# EAGLE schematic motor_board_tmc (EAGLE 9.6.2)

## Sheet 1 of 3
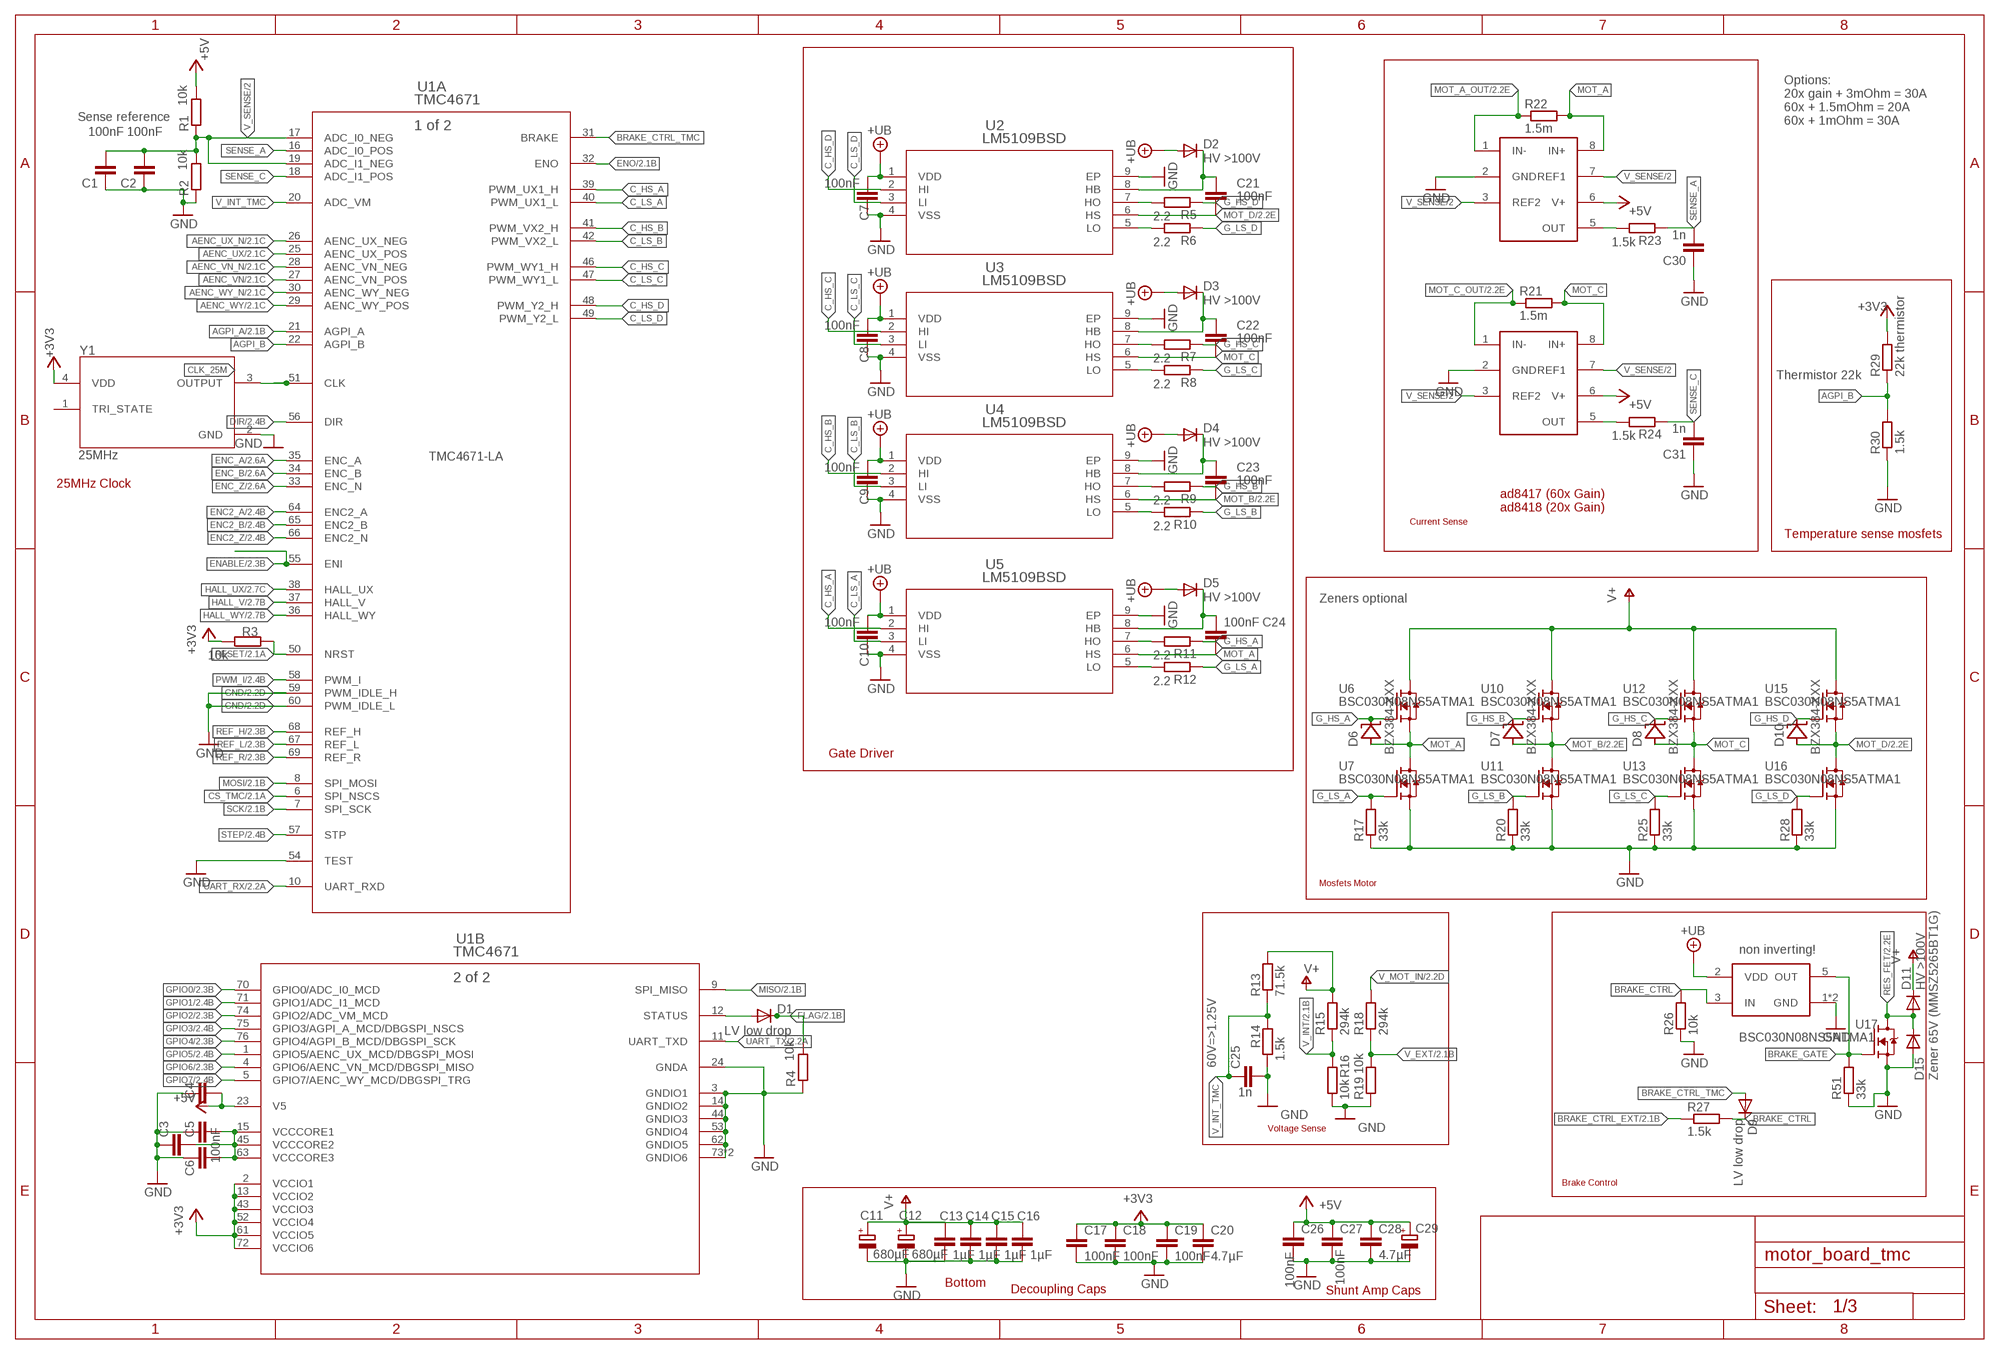
[diagram p0: schematic, sheet 1]

### Parts
C1  100nF  C-EUC0603  [C0603]
C2  100nF  C-EUC0603  [C0603]
C3  100nF  C-EUC0603  [C0603]
C4  100nF  C-EUC0603  [C0603]
C5  100nF  C-EUC0603  [C0603]
C6  100nF  C-EUC0603  [C0603]
C7  100nF  C-EUC0603  [C0603]
C8  100nF  C-EUC0603  [C0603]
C9  100nF  C-EUC0603  [C0603]
C10  100nF  C-EUC0603  [C0603]
C11  680µF  CPOL-EUE7.5-16  [E7,5-16]
C12  680µF  CPOL-EUE7.5-16  [E7,5-16]
C13  1µF  C-EUC1206  [C1206]
C14  1µF  C-EUC1206  [C1206]
C15  1µF  C-EUC1206  [C1206]
C16  1µF  C-EUC1206  [C1206]
C17  100nF  C-EUC0603  [C0603]
C18  100nF  C-EUC0603  [C0603]
C19  100nF  C-EUC0603  [C0603]
C20  4.7µF  C-EUC0805  [C0805]
C21  100nF  C-EUC0805  [C0805]
C22  100nF  C-EUC0805  [C0805]
C23  100nF  C-EUC0805  [C0805]
C24  100nF  C-EUC0805  [C0805]
C25  1n  C-EUC0603  [C0603]
C26  100nF  C-EUC0603  [C0603]
C27  100nF  C-EUC0603  [C0603]
C28  4.7µF  C-EUC0805  [C0805]
C29  CPOL-EUE5-8.5  [E5-8,5]
C30  1n  C-EUC0603  [C0603]
C31  1n  C-EUC0603  [C0603]
D1  LV low drop  DIODE_SOD-123FL  [SOD-123FL]
D2  HV >100V  DIODE_SOD-123FL  [SOD-123FL]
D3  HV >100V  DIODE_SOD-123FL  [SOD-123FL]
D4  HV >100V  DIODE_SOD-123FL  [SOD-123FL]
D5  HV >100V  DIODE_SOD-123FL  [SOD-123FL]
D6  BZX384-XXX  [SOD323-R]
D7  BZX384-XXX  [SOD323-R]
D8  BZX384-XXX  [SOD323-R]
D9  LV low drop  DIODE_SOD-123FL  [SOD-123FL]
D10  BZX384-XXX  [SOD323-R]
D11  HV >100V  DIODE_SOD-123FL  [SOD-123FL]
D15  Zener 65V (MMSZ5265BT1G)  DIODE_SOD-123FL  [SOD-123FL]
R1  10k  R-EU_R0603  [R0603]
R2  10k  R-EU_R0603  [R0603]
R3  10k  R-EU_R0603  [R0603]
R4  10k  R-EU_R0603  [R0603]
R5  2.2  R-EU_R0603  [R0603]
R6  2.2  R-EU_R0603  [R0603]
R7  2.2  R-EU_R0603  [R0603]
R8  2.2  R-EU_R0603  [R0603]
R9  2.2  R-EU_R0603  [R0603]
R10  2.2  R-EU_R0603  [R0603]
R11  2.2  R-EU_R0603  [R0603]
R12  2.2  R-EU_R0603  [R0603]
R13  71.5k  R-EU_R0805  [R0805]
R14  1.5k  R-EU_R0603  [R0603]
R15  294k  R-EU_R0805  [R0805]
R16  10k  R-EU_R0603  [R0603]
R17  33k  R-EU_R0603  [R0603]
R18  294k  R-EU_R0805  [R0805]
R19  10k  R-EU_R0603  [R0603]
R20  33k  R-EU_R0603  [R0603]
R21  1.5m  R-EU_R2512  [R2512]
R22  1.5m  R-EU_R2512  [R2512]
R23  1.5k  R-EU_R0603  [R0603]
R24  1.5k  R-EU_R0603  [R0603]
R25  33k  R-EU_R0603  [R0603]
R26  10k  R-EU_R0603  [R0603]
R27  1.5k  R-EU_R0603  [R0603]
R28  33k  R-EU_R0603  [R0603]
R29  22k thermistor  R-EU_R0603  [R0603]
R30  1.5k  R-EU_R0603  [R0603]
R51  33k  R-EU_R0603  [R0603]
U1  TMC4671  [QFN76_10P5X6P5]
U2  LM5109BSD  [SDC08A]
U3  LM5109BSD  [SDC08A]
U4  LM5109BSD  [SDC08A]
U5  LM5109BSD  [SDC08A]
U6  BSC030N08NS5ATMA1  [MOSFET_BSC093N04LSGATMA1]
U7  BSC030N08NS5ATMA1  [MOSFET_BSC093N04LSGATMA1]
U8  AD841X  [MSOP8]
U9  AD841X  [MSOP8]
U10  BSC030N08NS5ATMA1  [MOSFET_BSC093N04LSGATMA1]
U11  BSC030N08NS5ATMA1  [MOSFET_BSC093N04LSGATMA1]
U12  BSC030N08NS5ATMA1  [MOSFET_BSC093N04LSGATMA1]
U13  BSC030N08NS5ATMA1  [MOSFET_BSC093N04LSGATMA1]
U14  MCP14XX  [SOT23-5L]
U15  BSC030N08NS5ATMA1  [MOSFET_BSC093N04LSGATMA1]
U16  BSC030N08NS5ATMA1  [MOSFET_BSC093N04LSGATMA1]
U17  BSC030N08NS5ATMA1  [MOSFET_BSC093N04LSGATMA1]
Y1  25MHz  ECS-327KE-TR  [ECS-327KE-TR]

### Nets
+3V3: C17.1 C18.1 C19.1 C20.1 R3.2 R29.2 U1.2(B:VCCIO1) U1.13(B:VCCIO2) U1.43(B:VCCIO3) U1.52(B:VCCIO4) U1.61(B:VCCIO5) U1.72(B:VCCIO6) Y1.4(VDD) ; also sheet 2,3
+5V: C4.2 C26.1 C27.1 C28.1 C29.+ R1.2 U1.23(B:V5) U8.6(V+) U9.6(V+) ; also sheet 2,3
AENC_UX: U1.25(A:AENC_UX_POS) ; also sheet 2
AENC_UX_N: U1.26(A:AENC_UX_NEG) ; also sheet 2
AENC_VN: U1.27(A:AENC_VN_POS) ; also sheet 2
AENC_VN_N: U1.28(A:AENC_VN_NEG) ; also sheet 2
AENC_WY: U1.29(A:AENC_WY_POS) ; also sheet 2
AENC_WY_N: U1.30(A:AENC_WY_NEG) ; also sheet 2
AGPI_A: U1.21(A:AGPI_A) ; also sheet 2
AGPI_B: R29.1 R30.2 U1.22(A:AGPI_B)
BRAKE_CTRL: D9.C R26.2 R27.2 U14.3(IN)
BRAKE_CTRL_EXT: R27.1 ; also sheet 2
BRAKE_CTRL_TMC: D9.A U1.31(A:BRAKE)
BRAKE_GATE: R51.2 U14.5(OUT) U17.4(G)
C_HS_A: U1.39(A:PWM_UX1_H) U5.2(HI)
C_HS_B: U1.41(A:PWM_VX2_H) U4.2(HI)
C_HS_C: U1.46(A:PWM_WY1_H) U3.2(HI)
C_HS_D: U1.48(A:PWM_Y2_H) U2.2(HI)
C_LS_A: U1.40(A:PWM_UX1_L) U5.3(LI)
C_LS_B: U1.42(A:PWM_VX2_L) U4.3(LI)
C_LS_C: U1.47(A:PWM_WY1_L) U3.3(LI)
C_LS_D: U1.49(A:PWM_Y2_L) U2.3(LI)
CLK_25M: U1.51(A:CLK) Y1.3(OUTPUT)
CS_TMC: U1.6(A:SPI_NSCS) ; also sheet 2
DIR: U1.56(A:DIR) ; also sheet 2
ENABLE: U1.55(A:ENI) ; also sheet 2
ENC2_A: U1.64(A:ENC2_A) ; also sheet 2
ENC2_B: U1.65(A:ENC2_B) ; also sheet 2
ENC2_Z: U1.66(A:ENC2_N) ; also sheet 2
ENC_A: U1.35(A:ENC_A) ; also sheet 2
ENC_B: U1.34(A:ENC_B) ; also sheet 2
ENC_Z: U1.33(A:ENC_N) ; also sheet 2
ENO: U1.32(A:ENO) ; also sheet 2
FLAG: D1.C R4.2 ; also sheet 2
G_HS_A: D6.C R11.1 U6.4(G)
G_HS_B: D7.C R9.1 U10.4(G)
G_HS_C: D8.C R7.1 U12.4(G)
G_HS_D: D10.C R5.1 U15.4(G)
G_LS_A: R12.1 R17.2 U7.4(G)
G_LS_B: R10.1 R20.2 U11.4(G)
G_LS_C: R8.1 R25.2 U13.4(G)
G_LS_D: R6.1 R28.2 U16.4(G)
GND: C1.1 C2.1 C3.1 C4.1 C5.1 C6.1 C7.1 C8.1 C9.1 C10.1 C11.- C12.- C13.2 C14.2 C15.2 C16.2 C17.2 C18.2 C19.2 C20.2 C25.2 C26.2 C27.2 C28.2 C29.- C30.1 C31.1 D15.A R2.1 R4.1 R14.1 R16.1 R17.1 R19.1 R20.1 R25.1 R26.1 R28.1 R30.1 R51.1 U1.3(B:GNDIO1) U1.14(B:GNDIO2) U1.24(B:GNDA) U1.44(B:GNDIO3) U1.53(B:GNDIO4) U1.54(A:TEST) U1.59(A:PWM_IDLE_H) U1.60(A:PWM_IDLE_L) U1.62(B:GNDIO5) U1.73(B:GNDIO6) U1.77(B:GNDIO6) U2.4(VSS) U2.9(EP) U3.4(VSS) U3.9(EP) U4.4(VSS) U4.9(EP) U5.4(VSS) U5.9(EP) U7.1(S) U7.2(S) U7.3(S) U8.2(GND) U9.2(GND) U11.1(S) U11.2(S) U11.3(S) U13.1(S) U13.2(S) U13.3(S) U14.1(GND) U14.4(GND) U16.1(S) U16.2(S) U16.3(S) U17.1(S) U17.2(S) U17.3(S) Y1.2(GND) ; also sheet 2,3
GPIO0: U1.70(B:GPIO0/ADC_I0_MCD) ; also sheet 2
GPIO1: U1.71(B:GPIO1/ADC_I1_MCD) ; also sheet 2
GPIO2: U1.74(B:GPIO2/ADC_VM_MCD) ; also sheet 2
GPIO3: U1.75(B:GPIO3/AGPI_A_MCD/DBGSPI_NSCS) ; also sheet 2
GPIO4: U1.76(B:GPIO4/AGPI_B_MCD/DBGSPI_SCK) ; also sheet 2
GPIO5: U1.1(B:GPIO5/AENC_UX_MCD/DBGSPI_MOSI) ; also sheet 2
GPIO6: U1.4(B:GPIO6/AENC_VN_MCD/DBGSPI_MISO) ; also sheet 2
GPIO7: U1.5(B:GPIO7/AENC_WY_MCD/DBGSPI_TRG) ; also sheet 2
HALL_UX: U1.38(A:HALL_UX) ; also sheet 2
HALL_V: U1.37(A:HALL_V) ; also sheet 2
HALL_WY: U1.36(A:HALL_WY) ; also sheet 2
MISO: U1.9(B:SPI_MISO) ; also sheet 2
MOSI: U1.8(A:SPI_MOSI) ; also sheet 2
MOT_A: C24.2 D6.A R22.2 U5.6(HS) U6.1(S) U6.2(S) U6.3(S) U7.5(D) U8.8(IN+)
MOT_A_OUT: R22.1 U8.1(IN-) ; also sheet 2
MOT_B: C23.2 D7.A U4.6(HS) U10.1(S) U10.2(S) U10.3(S) U11.5(D) ; also sheet 2
MOT_C: C22.2 D8.A R21.2 U3.6(HS) U9.8(IN+) U12.1(S) U12.2(S) U12.3(S) U13.5(D)
MOT_C_OUT: R21.1 U9.1(IN-) ; also sheet 2
MOT_D: C21.2 D10.A U2.6(HS) U15.1(S) U15.2(S) U15.3(S) U16.5(D) ; also sheet 2
N$4: D1.A U1.12(B:STATUS)
N$6: R23.2 U8.5(OUT)
N$10: R24.2 U9.5(OUT)
N$13: R12.2 U5.5(LO)
N$18: C24.1 D5.C U5.8(HB)
N$27: R11.2 U5.7(HO)
N$28: C23.1 D4.C U4.8(HB)
N$29: R10.2 U4.5(LO)
N$30: R9.2 U4.7(HO)
N$31: C21.1 D2.C U2.8(HB)
N$32: R6.2 U2.5(LO)
N$33: R5.2 U2.7(HO)
N$34: C22.1 D3.C U3.8(HB)
N$35: R8.2 U3.5(LO)
N$36: R7.2 U3.7(HO)
PWM_I: U1.58(A:PWM_I) ; also sheet 2
REF_H: U1.68(A:REF_H) ; also sheet 2
REF_L: U1.67(A:REF_L) ; also sheet 2
REF_R: U1.69(A:REF_R) ; also sheet 2
RES_FET: D11.A D15.C U17.5(D) ; also sheet 2
RESET: R3.1 U1.50(A:NRST) ; also sheet 2
SCK: U1.7(A:SPI_SCK) ; also sheet 2
SENSE_A: C30.2 R23.1 U1.16(A:ADC_I0_POS)
SENSE_C: C31.2 R24.1 U1.18(A:ADC_I1_POS)
STEP: U1.57(A:STP) ; also sheet 2
UART_RX: U1.10(A:UART_RXD) ; also sheet 2
UART_TX: U1.11(B:UART_TXD) ; also sheet 2
V+: C11.+ C12.+ C13.1 C14.1 C15.1 C16.1 D11.C R13.2 R15.2 U6.5(D) U10.5(D) U12.5(D) U15.5(D) ; also sheet 2,3
V_EXT: R18.1 R19.2 ; also sheet 2
V_GD: C7.2 C8.2 C9.2 C10.2 D2.A D3.A D4.A D5.A U2.1(VDD) U3.1(VDD) U4.1(VDD) U5.1(VDD) U14.2(VDD) ; supply symbol labelled +UB ; also sheet 2,3
V_INT: R15.1 R16.2 ; also sheet 2
V_INT_TMC: C25.1 R13.1 R14.2 U1.20(A:ADC_VM)
V_MOT_IN: R18.2 ; also sheet 2,3
V_SENSE/2: C1.2 C2.2 R1.1 R2.2 U1.17(A:ADC_I0_NEG) U1.19(A:ADC_I1_NEG) U8.3(REF2) U8.7(REF1) U9.3(REF2) U9.7(REF1)
VCORE: C3.2 C5.2 C6.2 U1.15(B:VCCCORE1) U1.45(B:VCCCORE2) U1.63(B:VCCCORE3)
Unconnected: Y1.1(TRI_STATE)

### Notes on the sheet
- Sense reference
- Options:
  20x gain + 3mOhm = 30A
  60x + 1.5mOhm = 20A
  60x + 1mOhm = 30A
- Thermistor 22k
- TMC4671-LA
- 25MHz Clock
- Current Sense
- ad8417 (60x Gain)
  ad8418 (20x Gain)
- Temperature sense mosfets
- Zeners optional
- Gate Driver
- Mosfets Motor
- non inverting!
- 60V=>1.25V
- Voltage Sense
- Brake Control
- Bottom
- Decoupling Caps | Shunt Amp Caps

## Sheet 2 of 3
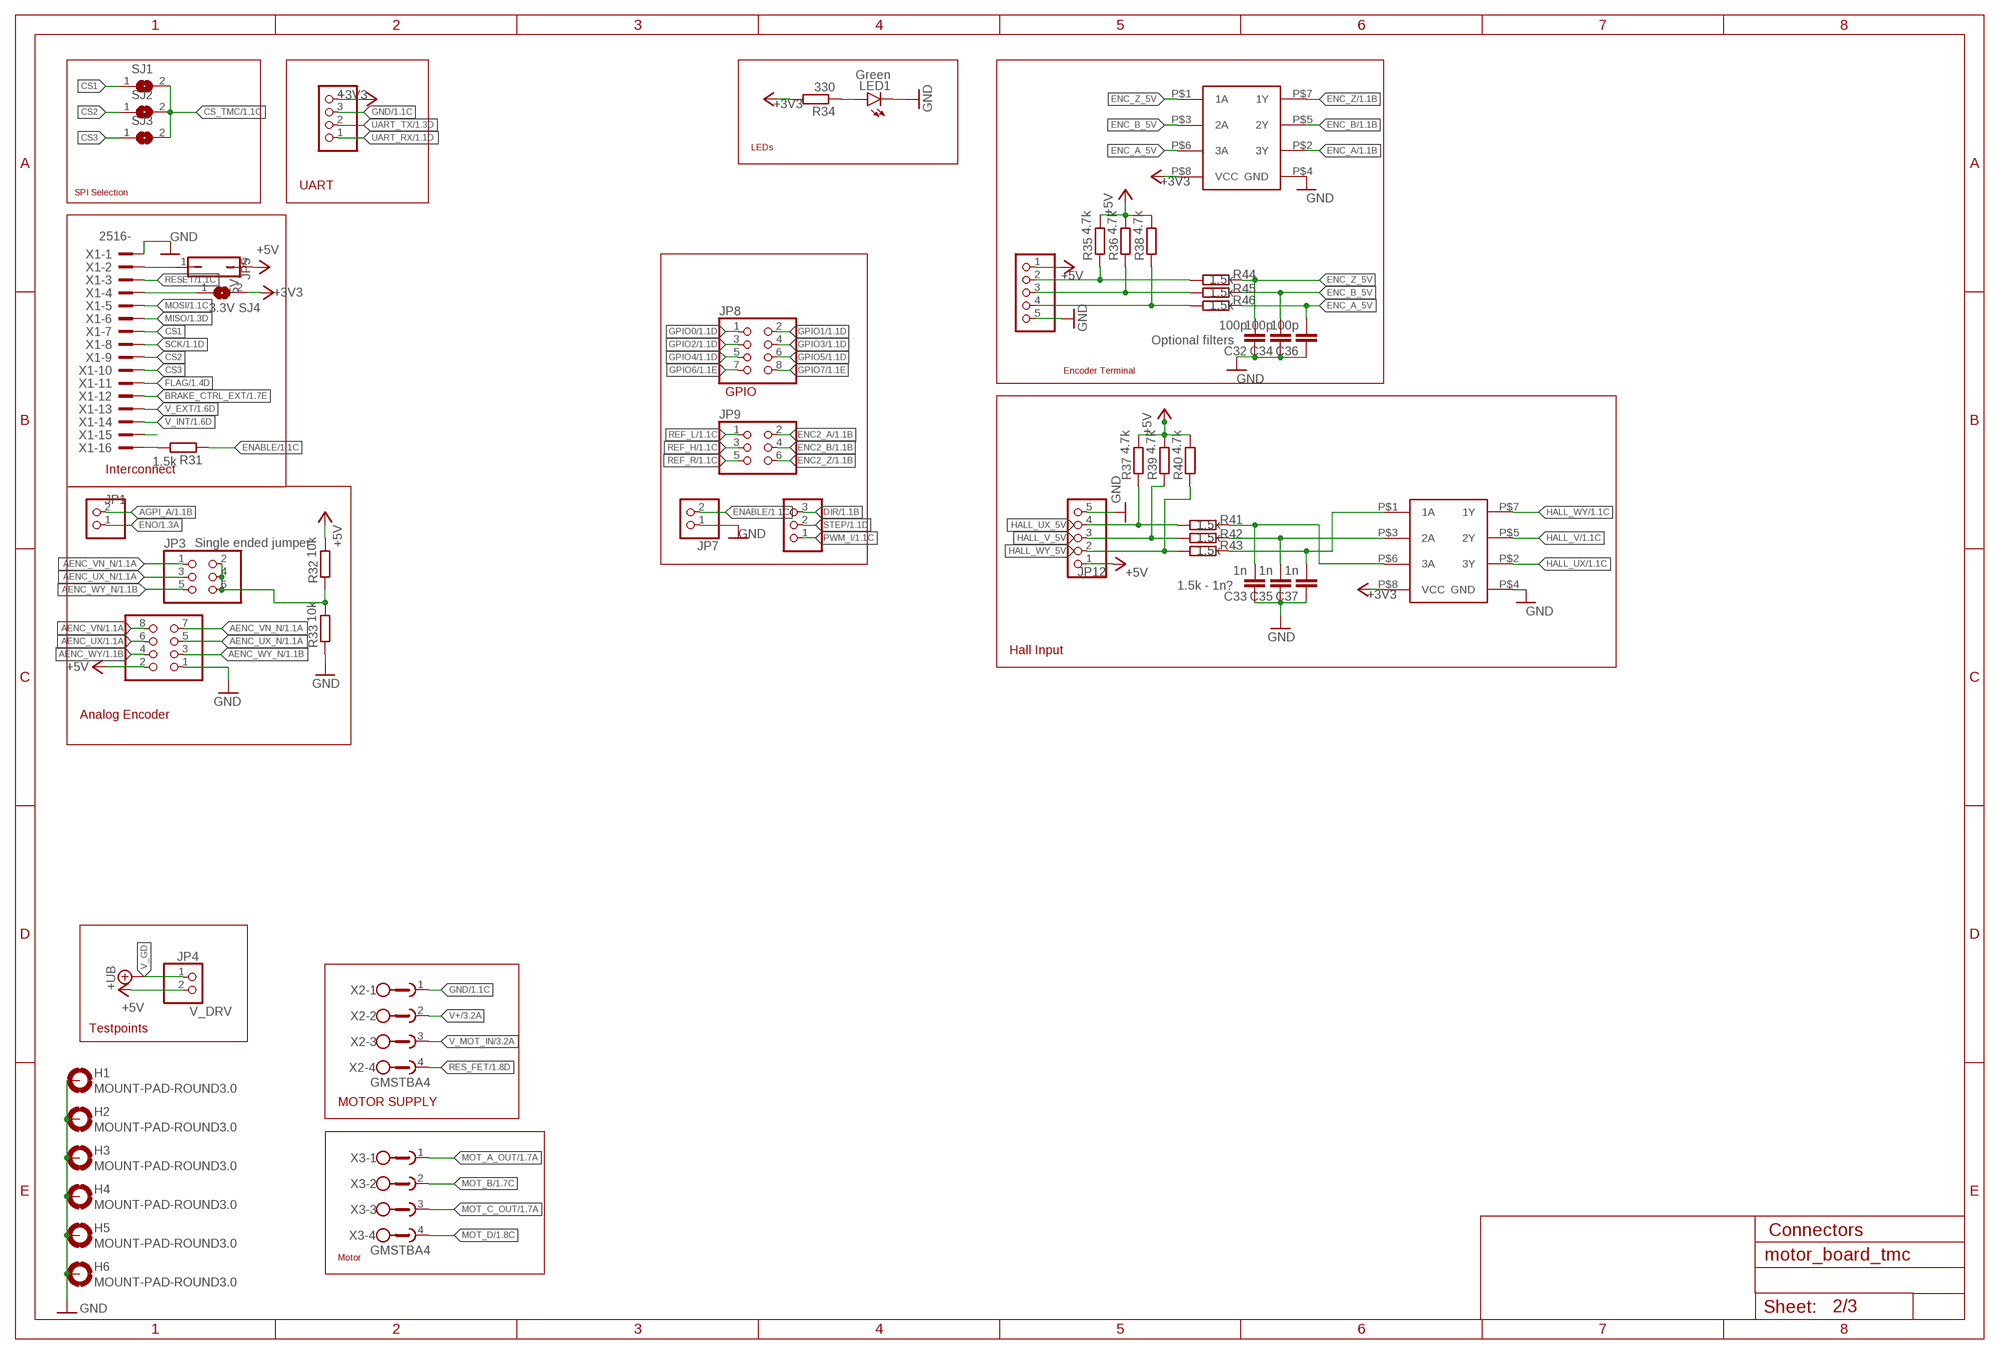
[diagram p1: schematic, sheet 2]

### Parts
C32  100p  C-EUC0603  [C0603]
C33  1n  C-EUC0603  [C0603]
C34  100p  C-EUC0603  [C0603]
C35  1n  C-EUC0603  [C0603]
C36  100p  C-EUC0603  [C0603]
C37  1n  C-EUC0603  [C0603]
H1  MOUNT-PAD-ROUND3.0  [3,0-PAD]
H2  MOUNT-PAD-ROUND3.0  [3,0-PAD]
H3  MOUNT-PAD-ROUND3.0  [3,0-PAD]
H4  MOUNT-PAD-ROUND3.0  [3,0-PAD]
H5  MOUNT-PAD-ROUND3.0  [3,0-PAD]
H6  MOUNT-PAD-ROUND3.0  [3,0-PAD]
JP1  PINHD-1X2  [1X02]
JP2  PINHD-2X4  [2X04]
JP3  PINHD-2X3  [2X03]
JP4  V_DRV  PINHD-1X2  [1X02]
JP5  5V  JP1Q  [JP1]
JP6  PINHD-1X4  [1X04]
JP7  PINHD-1X2  [1X02]
JP8  PINHD-2X4  [2X04]
JP9  PINHD-2X3  [2X03]
JP10  PINHD-1X3  [1X03]
JP11  PINHD-1X5  [1X05]
JP12  PINHD-1X5  [1X05]
LED1  Green  LEDSML0805  [SML0805]
R31  1.5k  R-EU_R0603  [R0603]
R32  10k  R-EU_R0603  [R0603]
R33  10k  R-EU_R0603  [R0603]
R34  330  R-EU_R0603  [R0603]
R35  4.7k  R-EU_R0603  [R0603]
R36  4.7k  R-EU_R0603  [R0603]
R37  4.7k  R-EU_R0603  [R0603]
R38  4.7k  R-EU_R0603  [R0603]
R39  4.7k  R-EU_R0603  [R0603]
R40  4.7k  R-EU_R0603  [R0603]
R41  1.5k  R-EU_R0603  [R0603]
R42  1.5k  R-EU_R0603  [R0603]
R43  1.5k  R-EU_R0603  [R0603]
R44  1.5k  R-EU_R0603  [R0603]
R45  1.5k  R-EU_R0603  [R0603]
R46  1.5k  R-EU_R0603  [R0603]
SJ1  SJ  [SJ]
SJ2  SJ  [SJ]
SJ3  SJ  [SJ]
SJ4  3.3V  SJ  [SJ]
U18  NC7NZ17K8X-3-BUFFER  [VFSOP-8]
U19  NC7NZ17K8X-3-BUFFER  [VFSOP-8]
X1  2516-  [PAK100/2500-16]
X2  GMSTBA4  [GMSTBA4]
X3  GMSTBA4  [GMSTBA4]

### Nets
+3V3: JP6.4 R34.2 SJ4.2 U18.P$8(VCC) U19.P$8(VCC) ; also sheet 1,3
+5V: JP2.2 JP4.2 JP5.2 JP11.1 JP12.1 R32.2 R35.2 R36.2 R37.2 R38.2 R39.2 R40.2 ; also sheet 1,3
AENC_UX: JP2.6 ; also sheet 1
AENC_UX_N: JP2.5 JP3.3 ; also sheet 1
AENC_VN: JP2.8 ; also sheet 1
AENC_VN_N: JP2.7 JP3.1 ; also sheet 1
AENC_WY: JP2.4 ; also sheet 1
AENC_WY_N: JP2.3 JP3.5 ; also sheet 1
AGPI_A: JP1.2 ; also sheet 1
BRAKE_CTRL_EXT: X1.12 ; also sheet 1
CS1: SJ1.1 X1.7
CS2: SJ2.1 X1.9
CS3: SJ3.1 X1.10
CS_TMC: SJ1.2 SJ2.2 SJ3.2 ; also sheet 1
DIR: JP10.3 ; also sheet 1
ENABLE: JP7.2 R31.1 ; also sheet 1
ENC2_A: JP9.2 ; also sheet 1
ENC2_B: JP9.4 ; also sheet 1
ENC2_Z: JP9.6 ; also sheet 1
ENC_A: U18.P$2(3Y) ; also sheet 1
ENC_A_5V: C36.2 R46.1 U18.P$6(3A)
ENC_B: U18.P$5(2Y) ; also sheet 1
ENC_B_5V: C34.2 R45.1 U18.P$3(2A)
ENC_Z: U18.P$7(1Y) ; also sheet 1
ENC_Z_5V: C32.2 R44.1 U18.P$1(1A)
ENO: JP1.1 ; also sheet 1
FLAG: X1.11 ; also sheet 1
GND: C32.1 C33.1 C34.1 C35.1 C36.1 C37.1 H1.B3,0(MOUNT) H2.B3,0(MOUNT) H3.B3,0(MOUNT) H4.B3,0(MOUNT) H5.B3,0(MOUNT) H6.B3,0(MOUNT) JP2.1 JP6.3 JP7.1 JP11.5 JP12.5 LED1.C R33.1 U18.P$4(GND) U19.P$4(GND) X1.1 X2.1 ; also sheet 1,3
GPIO0: JP8.1 ; also sheet 1
GPIO1: JP8.2 ; also sheet 1
GPIO2: JP8.3 ; also sheet 1
GPIO3: JP8.4 ; also sheet 1
GPIO4: JP8.5 ; also sheet 1
GPIO5: JP8.6 ; also sheet 1
GPIO6: JP8.7 ; also sheet 1
GPIO7: JP8.8 ; also sheet 1
HALL_UX: U19.P$2(3Y) ; also sheet 1
HALL_UX_5V: C33.2 R41.1 U19.P$6(3A)
HALL_V: U19.P$5(2Y) ; also sheet 1
HALL_V_5V: C35.2 R42.1 U19.P$3(2A)
HALL_WY: U19.P$7(1Y) ; also sheet 1
HALL_WY_5V: C37.2 R43.1 U19.P$1(1A)
MISO: X1.6 ; also sheet 1
MOSI: X1.5 ; also sheet 1
MOT_A_OUT: X3.1 ; also sheet 1
MOT_B: X3.2 ; also sheet 1
MOT_C_OUT: X3.3 ; also sheet 1
MOT_D: X3.4 ; also sheet 1
N$1: JP12.4 R37.1 R41.2
N$2: X1.15
N$3: JP12.3 R39.1 R42.2
N$7: JP11.4 R38.1 R46.2
N$8: LED1.A R34.1
N$9: JP11.3 R36.1 R45.2
N$11: JP11.2 R35.1 R44.2
N$15: JP12.2 R40.1 R43.2
N$17: R31.2 X1.16
N$20: SJ4.1 X1.4
N$22: JP3.2 JP3.4 JP3.6 R32.1 R33.2
N$23: JP5.1 X1.2
PWM_I: JP10.1 ; also sheet 1
REF_H: JP9.3 ; also sheet 1
REF_L: JP9.1 ; also sheet 1
REF_R: JP9.5 ; also sheet 1
RES_FET: X2.4 ; also sheet 1
RESET: X1.3 ; also sheet 1
SCK: X1.8 ; also sheet 1
STEP: JP10.2 ; also sheet 1
UART_RX: JP6.1 ; also sheet 1
UART_TX: JP6.2 ; also sheet 1
V+: X2.2 ; also sheet 1,3
V_EXT: X1.13 ; also sheet 1
V_GD: JP4.1 ; supply symbol labelled +UB ; also sheet 1,3
V_INT: X1.14 ; also sheet 1
V_MOT_IN: X2.3 ; also sheet 1,3

### Notes on the sheet
- LEDs
- UART
- SPI Selection
- Optional filters
- Encoder Terminal
- GPIO
- Interconnect
- Single ended jumper
- 1.5k - 1n?
- Hall Input
- Analog Encoder
- Testpoints
- MOTOR SUPPLY
- Connectors
- Motor

## Sheet 3 of 3
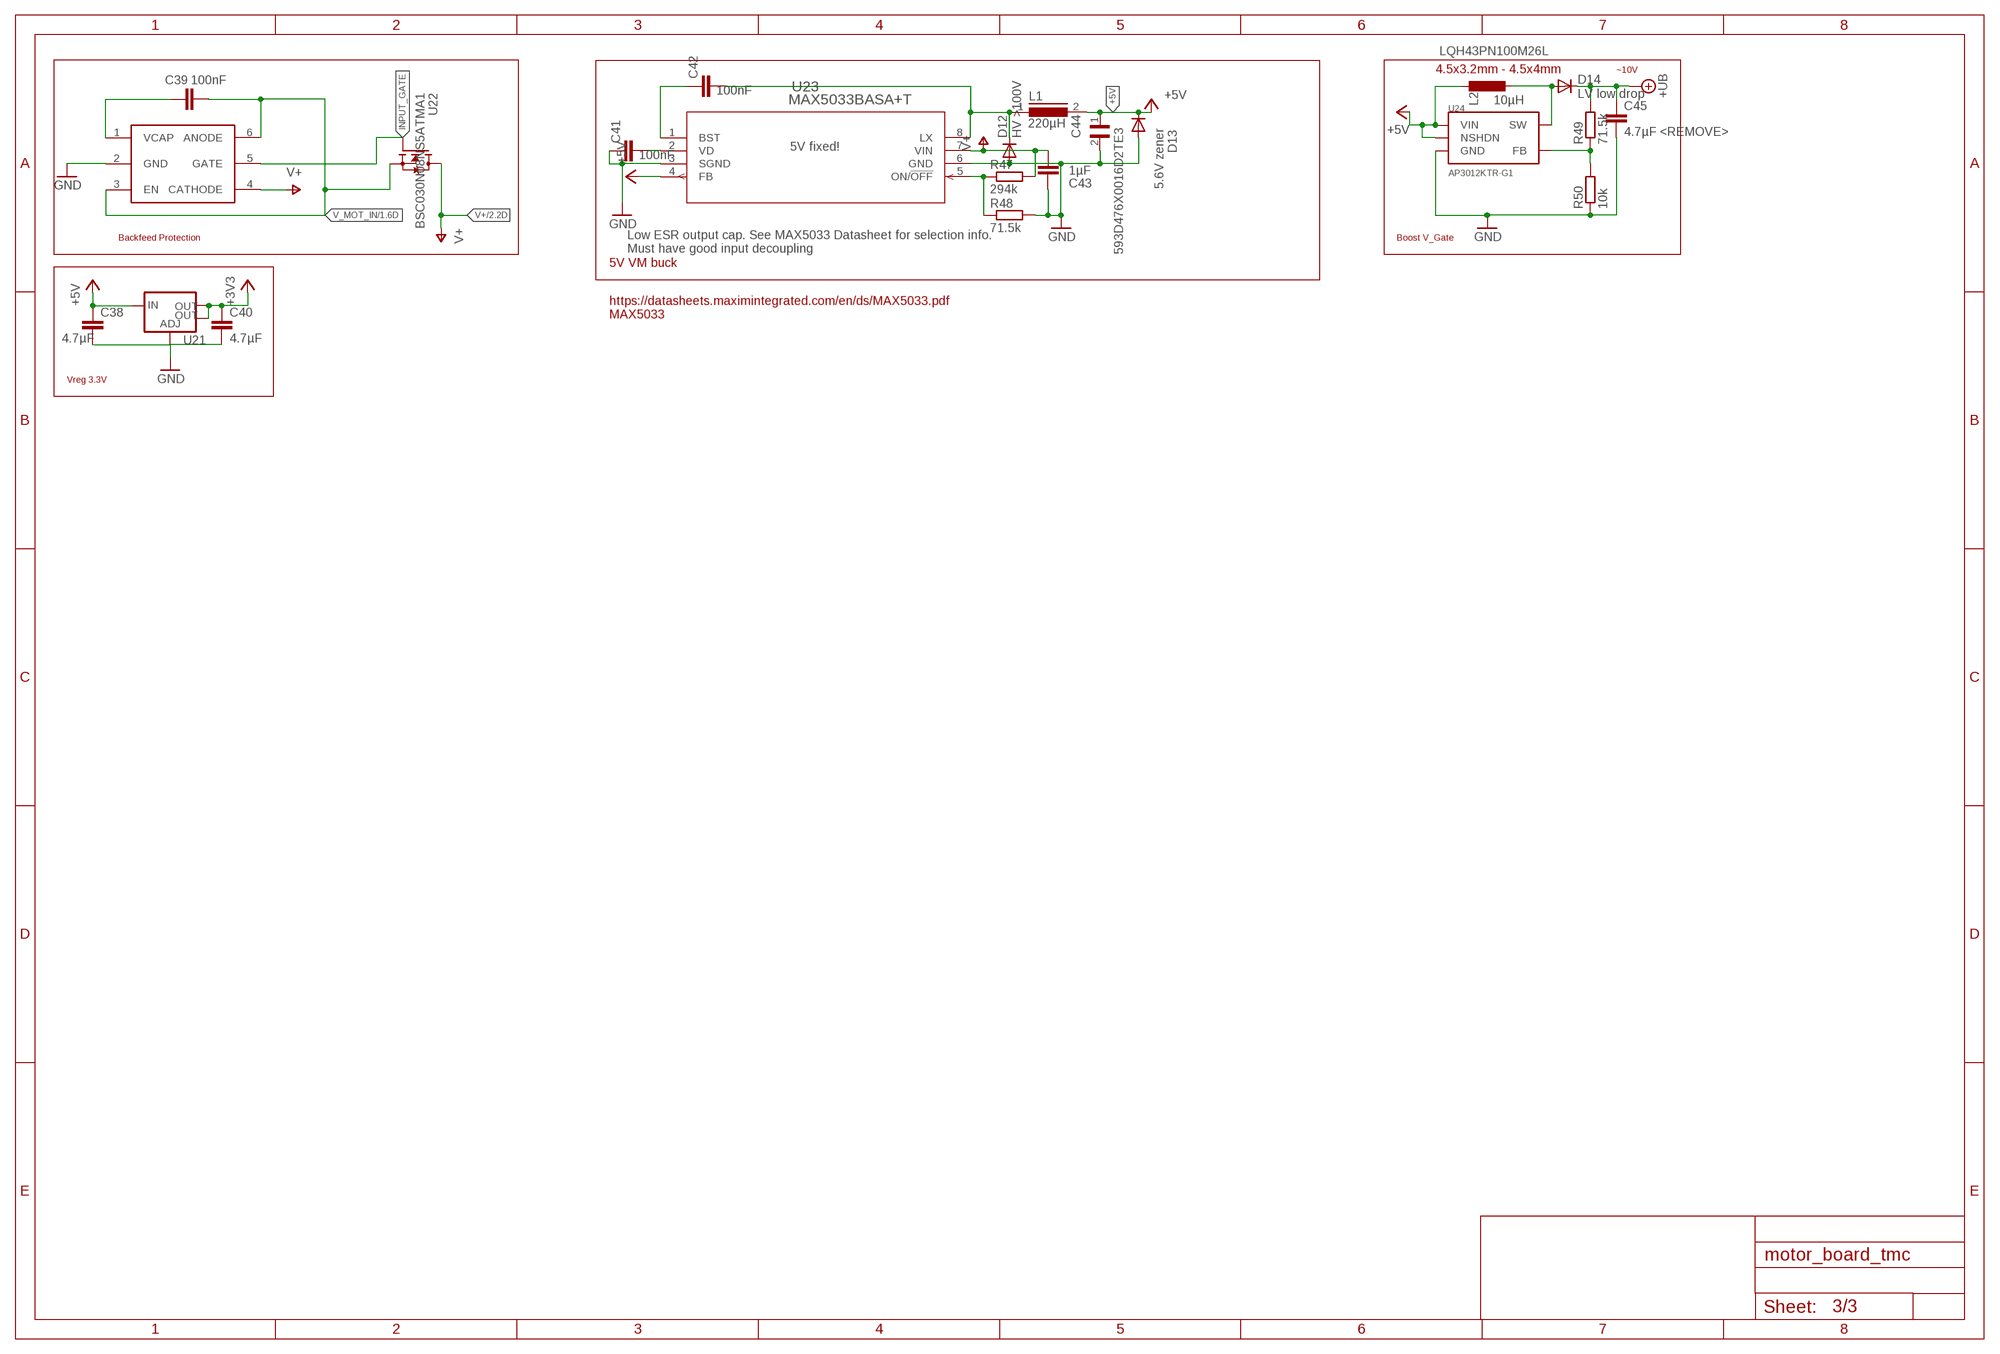
[diagram p2: schematic, sheet 3]

### Parts
C38  4.7µF  C-EUC0805  [C0805]
C39  100nF  C-EUC0805  [C0805]
C40  4.7µF  C-EUC0805  [C0805]
C41  100nF  C-EUC0603  [C0603]
C42  100nF  C-EUC0603  [C0603]
C43  1µF  C-EUC1206  [C1206]
C44  593D476X0016D2TE3  [CAPPM7343X310N]
C45  4.7µF <REMOVE>  C-EUC0805  [C0805]
D12  HV >100V  DIODE_SOD-123FL  [SOD-123FL]
D13  5.6V zener  DIODE_SOD-123FL  [SOD-123FL]
D14  LV low drop  DIODE_SOD-123FL  [SOD-123FL]
L1  220µH  8MMINDUCTOR  [8MMINDUCTOR]
L2  10µH  L-EUL4532P  [L4532P]
R47  294k  R-EU_R0805  [R0805]
R48  71.5k  R-EU_R0805  [R0805]
R49  71.5k  R-EU_R0805  [R0805]
R50  10k  R-EU_R0603  [R0603]
U20  LM74700-Q1  [SOT23-6]
U21  V_REG_LM1117SOT223  [SOT223]
U22  BSC030N08NS5ATMA1  [MOSFET_BSC093N04LSGATMA1]
U23  MAX5033BASA+T  [21-0041B_8_MXM]
U24  AP3012KTR-G1  [SOT23-5L]

### Nets
+3V3: C40.1 U21.2(OUT) U21.4(OUT) ; also sheet 1,2
+5V: C38.1 C44.1 D13.C L1.2 L2.1 U21.3(IN) U23.4(FB) U24.4(NSHDN) U24.5(VIN) ; also sheet 1,2
GND: C38.2 C40.2 C41.1 C43.1 C44.2 C45.2 D12.A D13.A R48.2 R50.1 U20.2(GND) U21.1(ADJ) U23.3(SGND) U23.6(GND) U24.2(GND) ; also sheet 1,2
INPUT_GATE: U20.5(GATE) U22.4(G)
N$5: R49.1 R50.2 U24.3(FB)
N$12: D14.A L2.2 U24.1(SW)
N$16: C42.2 D12.C L1.1 U23.8(LX)
N$19: C42.1 U23.1(BST)
N$21: R47.1 R48.1 U23.5(ON/!OFF)
N$24: C39.1 U20.1(VCAP)
N$25: C41.2 U23.2(VD)
V+: C43.2 R47.2 U20.4(CATHODE) U22.5(D) U23.7(VIN) ; also sheet 1,2
V_GD: C45.1 D14.C R49.2 ; supply symbol labelled +UB ; also sheet 1,2
V_MOT_IN: C39.2 U20.3(EN) U20.6(ANODE) U22.1(S) U22.2(S) U22.3(S) ; also sheet 1,2

### Notes on the sheet
- LQH43PN100M26L
- 4.5x3.2mm - 4.5x4mm | ~10V
- 5V fixed!
- Backfeed Protection | Boost V_Gate
- Low ESR output cap. See MAX5033 Datasheet for selection info.
  Must have good input decoupling
- 5V VM buck
- https://datasheets.maximintegrated.com/en/ds/MAX5033.pdf
  MAX5033
- Vreg 3.3V

## Library data of the parts
C1-C10 C13-C28 C30-C43 C45 = resistor:C-EU: CAPACITOR, European symbol
C11 C12 C29 = resistor:CPOL-EU: POLARIZED CAPACITOR, European symbol
C44 = Powermisc:593D476X0016D2TE3: 593D Series 47 uF ±20% 16 V Surface Mount Molded Solid Tantalum Capacitor; ARROW_ELECTRONICS-PURCHASE-URL: https://snapeda.com/shop?store=Arrow+Electronics&id=1736527; DESCRIPTION: 47µF Molded Tantalum Capacitors 16V 2917 (7343 Metric) 150mOhm; DIGI-KEY_PART_NUMBER: 718-2142-1-ND; MF: Vishay Sprague; MOUSER-PURCHASE-URL: https://snapeda.com/shop?store=Mouser&id=1736527; MP: 593D476X0016D2TE3; PACKAGE: 2917 Vishay
D1-D5 D9 D11-D15 = adafruit:DIODE: Diode SMADIODE - SMA Surface Mount Package 20V 1A Schottky Diode Digikey: 641-1014-6-ND DO-1N4148 - Through Hole Small Current Diode SOD-123 20V 1 A (.5mV Vf) Schottky Diode - Digikey: MBRX120TPMSCT-ND SOD-323 10V 570mA (.38mV Vf, 3ns) Schottky Diode - Digikey: ZLLS410CT-ND SOD-523 30V 30mA Schottky Diode (RB751S-40TE61) - Digikey: RB751S-40TE61CT-ND SOT23-R/W - SOT23 Package (R = Solder Paste/Reflow Ovens, W = Hand-Soldering) BAT54Film 40V 300mA - Digikey: 497-7162-1-ND
D6-D8 D10 = Powermisc:BZX384-XXX
H1-H6 = holes:MOUNT-PAD-ROUND: MOUNTING PAD, round
JP1 JP4 JP7 = pinhead:PINHD-1X2: PIN HEADER
JP2 JP8 = pinhead:PINHD-2X4: PIN HEADER
JP3 JP9 = pinhead:PINHD-2X3: PIN HEADER
JP5 = jumper:JP1Q: JUMPER
JP6 = pinhead:PINHD-1X4: PIN HEADER
JP10 = pinhead:PINHD-1X3: PIN HEADER
JP11 JP12 = pinhead:PINHD-1X5: PIN HEADER
L1 = Powermisc:8MMINDUCTOR: Inductor; SPICEPREFIX: L
L2 = rcl:L-EU: INDUCTOR, European symbol; SPICEPREFIX: L
LED1 = led:LED: LED OSRAM: - CHIPLED LG R971, LG N971, LY N971, LG Q971, LY Q971, LO R971, LY R971 LH N974, LH R974 LS Q976, LO Q976, LY Q976 LO Q996 - Hyper CHIPLED LW Q18S LB Q993, LB Q99A, LB R99A - SideLED LS A670, LO A670, LY A670, LG A670, LP A670 LB A673, LV A673, LT A673, LW A673 LH A674 LY A675 LS A676, LA A676, LO A676, LY A676, LW A676 LS A679, LY A679, LG A679 - Hyper Micro SIDELED® LS Y876, LA Y876, LO Y876, LY Y876 LT Y87S - SmartLED LW L88C, LW L88S LB L89C, LB L89S, LG L890 LS L89K, LO L89K, LY L89K LS L896, LA L896, LO L896, LY L896 - TOPLED LS T670, LO T670, LY T670, LG T670, LP T670 LSG T670, LSP T670, LSY T670, LOP T670, LYG T670 LG T671, LOG T671, LSG T671 LB T673, LV T673, LT T673, LW T673 LH T674 LS T676, LA T676, LO T676, LY T676, LB T676, LH T676, LSB T676, LW T676 LB T67C, LV T67C, LT T67C, LS T67K, LO T67K, LY T67K, LW E67C LS E67B, LA E67B, LO E67B, LY E67B, LB E67C, LV E67C, LT E67C LW T67C LS T679, LY T679, LG T679 LS T770, LO T770, LY T770, LG T770, LP T770 LB T773, LV T773, LT T773, LW T773 LH T774 LS E675, LA E675, LY E675, LS T675 LS T776, LA T776, LO T776, LY T776, LB T776 LHGB T686 LT T68C, LB T68C - Hyper Mini TOPLED® LB M676 - Mini TOPLED Santana® LG M470 LS M47K, LO M47K, LY M47K Source: http://www.osram.convergy.de LUXEON: - LUMILED® LXK2-PW12-R00, LXK2-PW12-S00, LXK2-PW14-U00, LXK2-PW14-V00 LXK2-PM12-R00, LXK2-PM12-S00, LXK2-PM14-U00 LXK2-PE12-Q00, LXK2-PE12-R00, LXK2-PE12-S00, LXK2-PE14-T00, LXK2-PE14-U00 LXK2-PB12-K00, LXK2-PB12-L00, LXK2-PB12-M00, LXK2-PB14-N00, LXK2-PB14-P00, LXK2-PB14-Q00 LXK2-PR12-L00, LXK2-PR12-M00, LXK2-PR14-Q00, LXK2-PR14-R00 LXK2-PD12-Q00, LXK2-PD12-R00, LXK2-PD12-S00 LXK2-PH12-R00, LXK2-PH12-S00 LXK2-PL12-P00, LXK2-PL12-Q00, LXK2-PL12-R00 Source: www.luxeon.com KINGBRIGHT: KA-3528ASYC Source: www.kingbright.com
R1-R51 = resistor:R-EU_: RESISTOR, European symbol
SJ1-SJ4 = jumper:SJ: SMD solder JUMPER
U1 = Trinamic:TMC4671; MANUFACTURER_PART_NUMBER: TMC4671ES; VENDOR: TRINAMIC
U2-U5 = Powermisc:LM5109BSD; MANUFACTURER_PART_NUMBER: lm5109bsd; VENDOR: Texas Instruments
U6 U7 U10-U13 U15-U17 U22 = OHSC_Power:BSC030N08NS5ATMA1: None; AVAILABILITY: Unavailable; DESCRIPTION: N-Channel 80 V 100 A 3 mO 61 nC SMT OptiMOS Power Mosfet - SuperSO-8; MF: Infineon Technologies; MP: BSC030N08NS5ATMA1; PACKAGE: PowerTDFN-8 Infineon; PRICE: None
U8 U9 = Powermisc:AD841X
U14 = Powermisc:MCP14XX
U18 U19 = Powermisc:NC7NZ17K8X-3-BUFFER
U20 = OHSC_Power:LM74700-Q1
U21 = SparkFun-IC-Power:V_REG_LM1117: Voltage Regulator LM1117 Standard adjustable voltage regulator but in SMD form. Spark Fun Electronics SKU : COM-00595; PROD_ID: VREG-08170
U23 = Powermisc:MAX5033BASA+T; BUILT_BY: EMA_UL_Team; MANUFACTURER_PART_NUMBER: max5033basa+T; SOURCELIBRARY: Maxim_2014-06-20; VENDOR: Maxim Integrated Products
U24 = Powermisc:AP3012KTR-G1
X1 = con-3m:2516-: 3M (TM) Pak 100 4-Wall Header Source: 3M; OC_FARNELL: unknown; OC_NEWARK: unknown
X2 X3 = con-phoenix-762:GMSTBA4: PHOENIX; MF: FARNELL; MPN: 1757268; OC_FARNELL: 3705195; OC_NEWARK: 71C4163
Y1 = Crystals:ECS-327KE-TR: XTAL OSC XO 32.7680KHZ CMOS SMD Manufacturer's datasheet <https://ecsxtal.com/store/pdf/ECS_327KE.pdf>; CREATED_BY: PCBLayout.com; DIGIKEY_PART_NUMBER: XC1751TR-ND; MANUFACTURER: ECS Inc.; MPN: ECS-327KE-TR; PACKAGE: 4-SMD